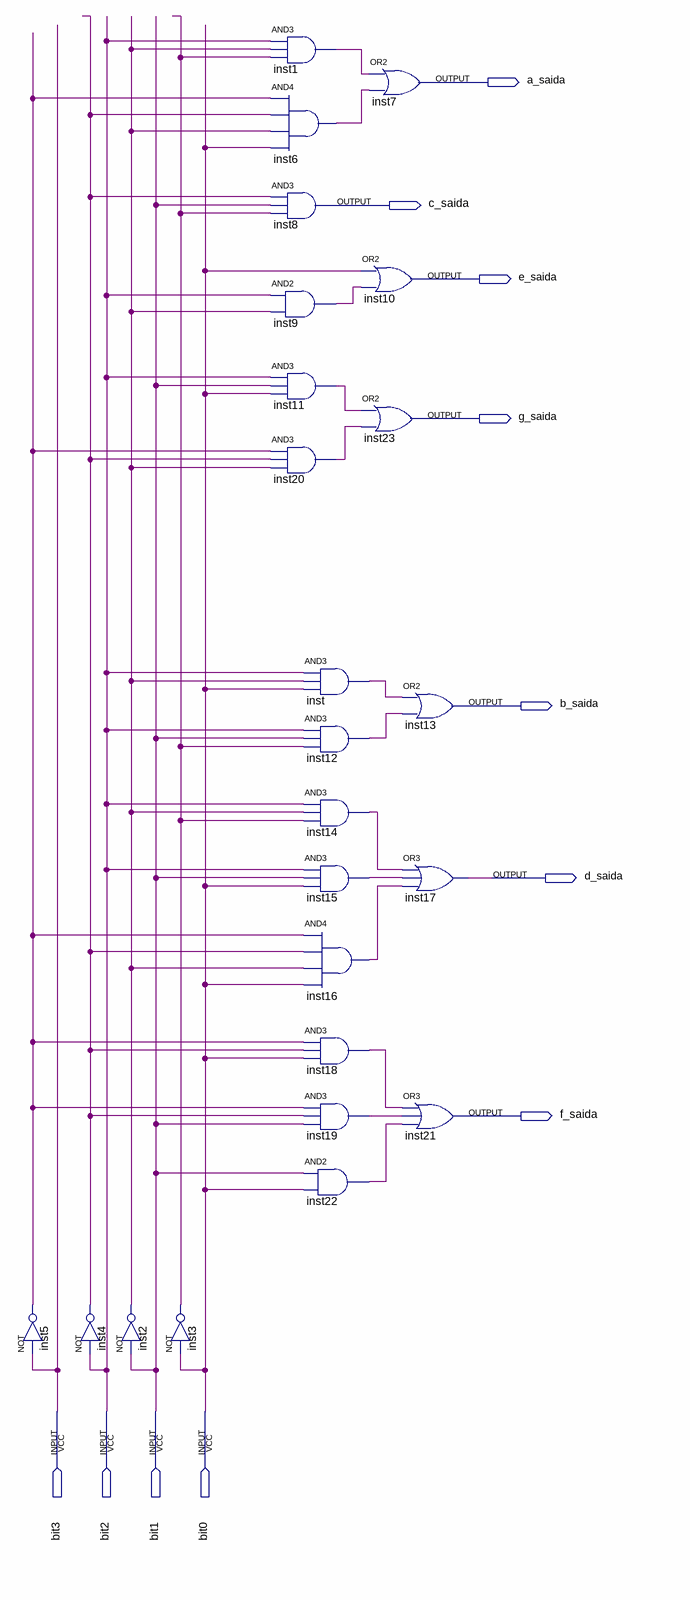
[diagram p0: schematic sheet]
// Quartus schematic seg.bdf as structural Verilog: 24 symbols, 11 pins
module seg (
  input  bit3,
  input  bit2,
  input  bit1,
  input  bit0,
  output a_saida,
  output c_saida,
  output e_saida,
  output g_saida,
  output b_saida,
  output d_saida,
  output f_saida
);

  wire inst1_out, inst2_out, inst3_out, inst4_out, inst5_out, inst6_out, inst9_out, inst11_out, inst12_out,
       inst14_out, inst15_out, inst16_out, inst18_out, inst19_out, inst20_out, inst22_out, inst_out;

  not inst5 (inst5_out, bit3);
  not inst2 (inst2_out, bit1);
  not inst4 (inst4_out, bit2);
  not inst3 (inst3_out, bit0);
  and inst1 (inst1_out, bit2, inst2_out, inst3_out);
  and inst6 (inst6_out, inst5_out, inst4_out, inst2_out, bit0);
  and inst8 (c_saida, inst4_out, bit1, inst3_out);
  and inst9 (inst9_out, bit2, inst2_out);
  and inst11 (inst11_out, bit2, bit1, bit0);
  and inst20 (inst20_out, inst5_out, inst4_out, inst2_out);
  and inst (inst_out, bit2, inst2_out, bit0);
  and inst12 (inst12_out, bit2, bit1, inst3_out);
  and inst14 (inst14_out, bit2, inst2_out, inst3_out);
  and inst15 (inst15_out, bit2, bit1, bit0);
  and inst16 (inst16_out, inst5_out, inst4_out, inst2_out, bit0);
  and inst18 (inst18_out, inst5_out, inst4_out, bit0);
  and inst19 (inst19_out, inst5_out, inst4_out, bit1);
  and inst22 (inst22_out, bit1, bit0);
  or inst7 (a_saida, inst1_out, inst6_out);
  or inst10 (e_saida, bit0, inst9_out);
  or inst23 (g_saida, inst11_out, inst20_out);
  or inst13 (b_saida, inst_out, inst12_out);
  or inst17 (d_saida, inst14_out, inst15_out, inst16_out);
  or inst21 (f_saida, inst18_out, inst19_out, inst22_out);
endmodule
